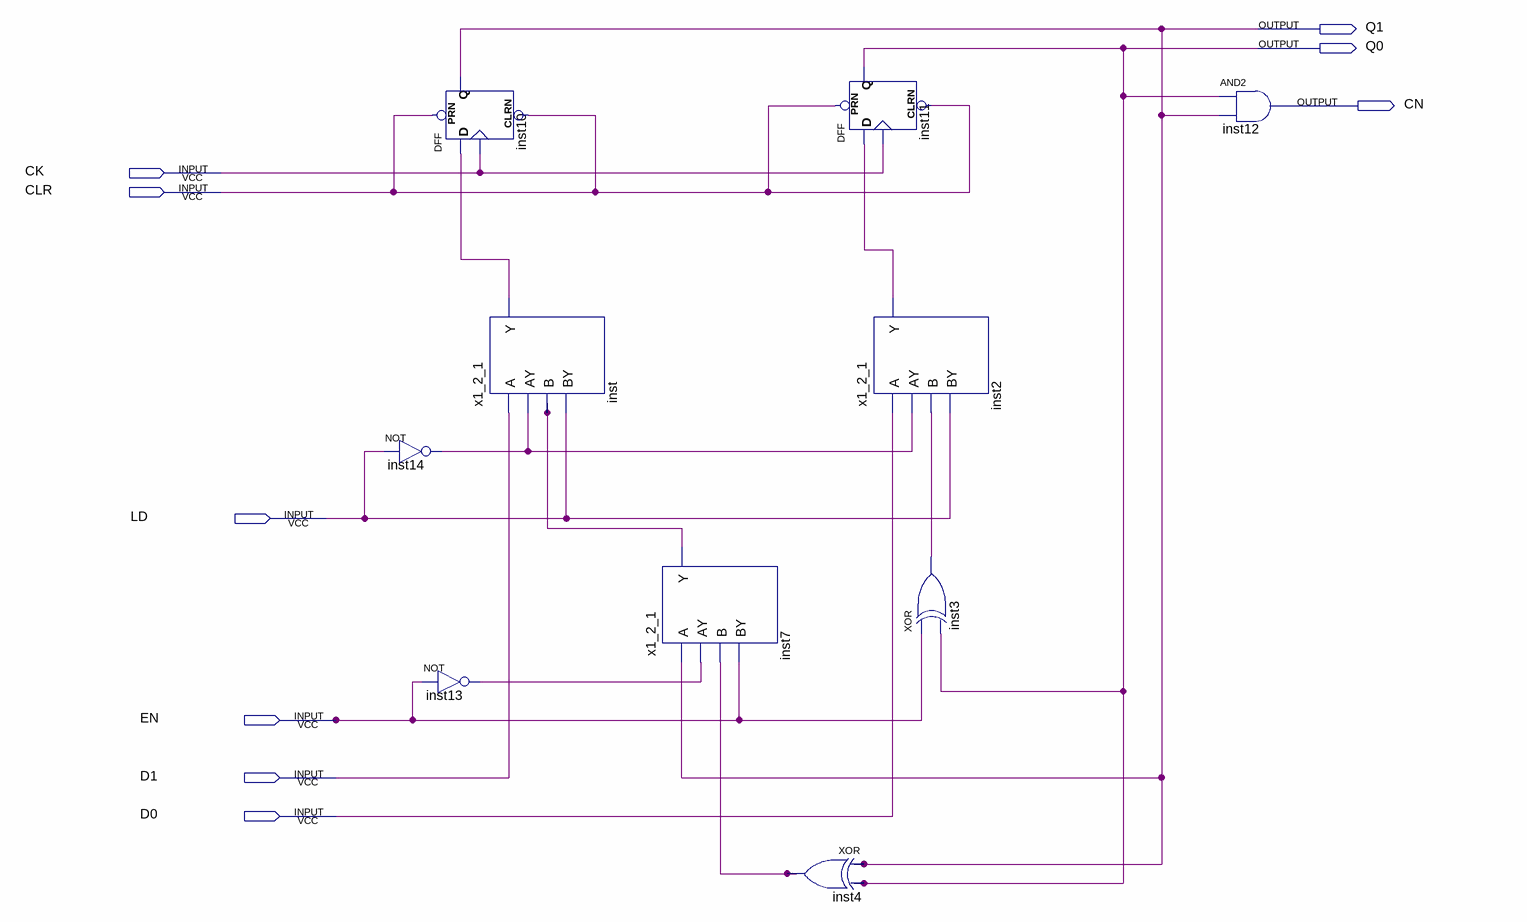
[diagram p0: schematic sheet]
// Quartus schematic count_2.bdf as structural Verilog: 10 symbols, 9 pins
module count_2 (
  input  CK,
  input  CLR,
  input  LD,
  input  EN,
  input  D1,
  input  D0,
  output Q1,
  output Q0,
  output CN
);

  wire inst2_y, inst3_out, inst4_out, inst7_y, inst13_out, inst14_out, inst_y;

  not inst14 (inst14_out, LD);
  DFF inst10 (.CLRN(CLR), .CLK(CK), .D(inst_y), .PRN(CLR), .Q(Q1));
  x1_2_1 inst (.A(D1), .AY(inst14_out), .B(inst7_y), .BY(LD), .Y(inst_y));
  not inst13 (inst13_out, EN);
  x1_2_1 inst7 (.A(Q1), .AY(inst13_out), .B(inst4_out), .BY(EN), .Y(inst7_y));
  xor inst4 (inst4_out, Q1, Q0);
  DFF inst11 (.CLRN(CLR), .CLK(CK), .D(inst2_y), .PRN(CLR), .Q(Q0));
  x1_2_1 inst2 (.A(D0), .AY(inst14_out), .B(inst3_out), .BY(LD), .Y(inst2_y));
  xor inst3 (inst3_out, EN, Q0);
  and inst12 (CN, Q0, Q1);
endmodule
